# Altium schematic sheet Slaves_Testbench.SchDoc
size A4 portrait; SheetNumber: 1; SheetTotal: 1
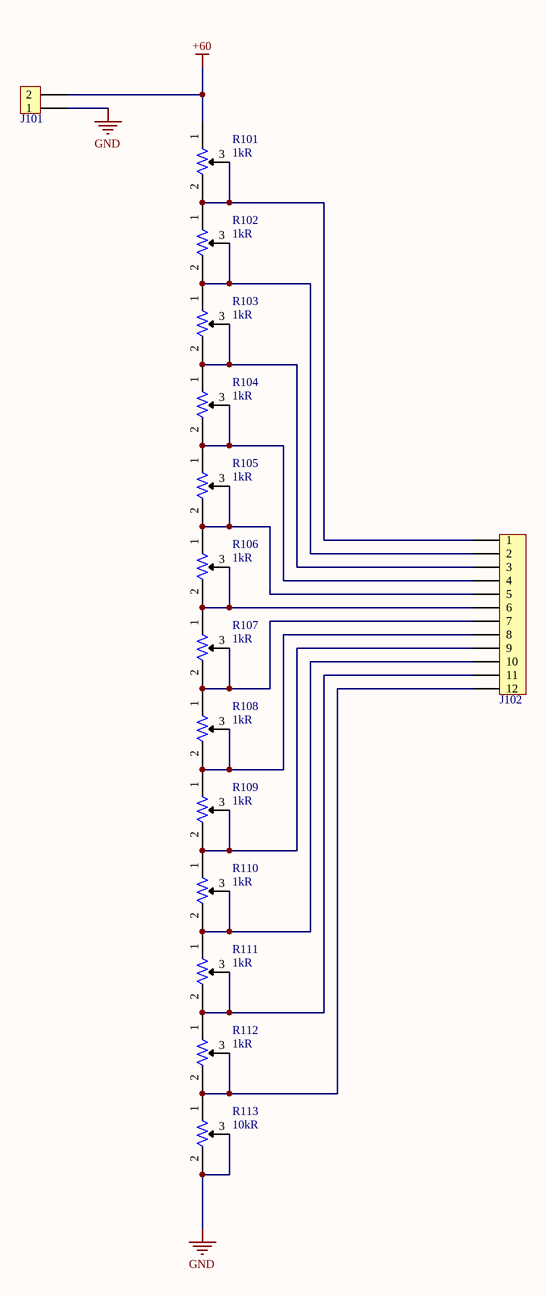
[diagram p0: Slaves_Testbench.SchDoc]

## Parts
J101  282836-2  [J_screw_1x2]  (value not drawn)
J102  436501200  [J_MicroFit_1x12]  (value not drawn)
R101  Resistance: 1kR  [R-VTR_RM065]  (hidden comment: R1k-VTR_RM065)
R102  Resistance: 1kR  [R-VTR_RM065]  (hidden comment: R1k-VTR_RM065)
R103  Resistance: 1kR  [R-VTR_RM065]  (hidden comment: R1k-VTR_RM065)
R104  Resistance: 1kR  [R-VTR_RM065]  (hidden comment: R1k-VTR_RM065)
R105  Resistance: 1kR  [R-VTR_RM065]  (hidden comment: R1k-VTR_RM065)
R106  Resistance: 1kR  [R-VTR_RM065]  (hidden comment: R1k-VTR_RM065)
R107  Resistance: 1kR  [R-VTR_RM065]  (hidden comment: R1k-VTR_RM065)
R108  Resistance: 1kR  [R-VTR_RM065]  (hidden comment: R1k-VTR_RM065)
R109  Resistance: 1kR  [R-VTR_RM065]  (hidden comment: R1k-VTR_RM065)
R110  Resistance: 1kR  [R-VTR_RM065]  (hidden comment: R1k-VTR_RM065)
R111  Resistance: 1kR  [R-VTR_RM065]  (hidden comment: R1k-VTR_RM065)
R112  Resistance: 1kR  [R-VTR_RM065]  (hidden comment: R1k-VTR_RM065)
R113  Resistance: 10kR  [R-VTR_RM065]  (hidden comment: R10k-VTR_RM065)

## Nets
+60: J101.2 R101.1
GND: J101.1 R113.2 R113.3
NetJ102_1: J102.1 R101.2 R101.3 R102.1
NetJ102_2: J102.2 R102.2 R102.3 R103.1
NetJ102_3: J102.3 R103.2 R103.3 R104.1
NetJ102_4: J102.4 R104.2 R104.3 R105.1
NetJ102_5: J102.5 R105.2 R105.3 R106.1
NetJ102_6: J102.6 R106.2 R106.3 R107.1
NetJ102_7: J102.7 R107.2 R107.3 R108.1
NetJ102_8: J102.8 R108.2 R108.3 R109.1
NetJ102_9: J102.9 R109.2 R109.3 R110.1
NetJ102_10: J102.10 R110.2 R110.3 R111.1
NetJ102_11: J102.11 R111.2 R111.3 R112.1
NetJ102_12: J102.12 R112.2 R112.3 R113.1

## Library data of the parts
J101 = J_CON2x1: Connector, Terminal Block; Wire Receptacle; 2 Pos.; 16-30 AWG; 0.197 in. CL; Sid; Manufacturer 1: TE Connectivity; Supplier 1: Arrow Electronics; Manufacturer Part Number 1: 282836-2; RoHS: Yes; Category: Terminal Blocks; Stock 1: 8391; Pricing 1: 1=0,41710, 10=0,36230, 100=0,30770, 500=0,29220, 1000=0,26130, 2500=0,23640, 5000=0,21140, 10000=0,20690, 25000=0,20320 (USD); ComponentLink1URL: https://datasheet.ciiva.com/15169/getdatasheetpartid-155855-15169553.pdf?src-supplier=Verical; ComponentLink1Description: https://datasheet.ciiva.com/15169/getdatasheetpartid-155855-15169553.pdf?src-supplier=Verical; ComponentLink2URL: https://datasheet.ciiva.com/16393/282836-2-16393382.pdf?src-supplier=Future+Electronics; ComponentLink2Description: https://datasheet.ciiva.com/16393/282836-2-16393382.pdf?src-supplier=Future+Electronics; ComponentLink3URL: https://datasheet.ciiva.com/11757/0900766b8002dc8a-11757385.pdf?src-supplier=RSComponents; ComponentLink3Description: https://datasheet.ciiva.com/11757/0900766b8002dc8a-11757385.pdf?src-supplier=RSComponents; ComponentLink4URL: https://datasheet.ciiva.com/7628/1731782-7628513.pdf?src-supplier=Element14; ComponentLink4Description: https://datasheet.ciiva.com/7628/1731782-7628513.pdf?src-supplier=Element14; ComponentLink5URL: https://datasheet.ciiva.com/823/eng-cd-282836-h10-823437.pdf?src-supplier=Digi-Key; ComponentLink5Description: https://datasheet.ciiva.com/823/eng-cd-282836-h10-823437.pdf?src-supplier=Digi-Key; ComponentLink6URL: https://datasheet.ciiva.com/3141/eng-cs-1308389-eurostyle-terminal-blocks-0607-3141118.pdf?src-supplier=Avnet; ComponentLink6Description: https://datasheet.ciiva.com/3141/eng-cs-1308389-eurostyle-terminal-blocks-0607-3141118.pdf?src-supplier=Avnet; ComponentLink7URL: https://datasheet.ciiva.com/30261/eng-cs-1308389-eurostyle-terminal-blocks-0607-30261813.pdf?src-supplier=Onlinecomponents.com; ComponentLink7Description: https://datasheet.ciiva.com/30261/eng-cs-1308389-eurostyle-terminal-blocks-0607-30261813.pdf?src-supplier=Onlinecomponents.com; Supplier Part Number 1: 282836-2
J102 = J_MicroFit_1x12: Conn Power HDR 12 POS 3mm Solder RA Thru-Hole 12 Terminal 1 Port Micro-Fit 3.0™ Frame; Manufacturer 1: Molex; Manufacturer Part Number 1: 43650-1200; .Creator: DR; Supplier 1: Newark; RoHS: Yes; Category: Headers and Wire Housings; Stock 1: 13; Pricing 1: 1=3,36000, 10=2,96000, 25=2,76000, 50=2,56000, 100=2,36000, 250=2,08000 (USD); ComponentLink1URL: https://datasheet.ciiva.com/713/436500501-sd-713883.pdf?src-supplier=Digi-Key; ComponentLink1Description: https://datasheet.ciiva.com/713/436500501-sd-713883.pdf?src-supplier=Digi-Key; ComponentLink2URL: https://datasheet.ciiva.com/30240/0436501200-pcb-headers-30240499.pdf?src-supplier=Onlinecomponents.com; ComponentLink2Description: https://datasheet.ciiva.com/30240/0436501200-pcb-headers-30240499.pdf?src-supplier=Onlinecomponents.com; ComponentLink3URL: https://datasheet.ciiva.com/5150/0436501200-pcb-headers-168537-5150117.pdf?src-supplier=Mouser; ComponentLink3Description: https://datasheet.ciiva.com/5150/0436501200-pcb-headers-168537-5150117.pdf?src-supplier=Mouser; ComponentLink4URL: https://datasheet.ciiva.com/16086/1031430436501200-pcb-headers-16086097.pdf?src-supplier=Onlinecomponents.com; ComponentLink4Description: https://datasheet.ciiva.com/16086/1031430436501200-pcb-headers-16086097.pdf?src-supplier=Onlinecomponents.com; ComponentLink5URL: https://datasheet.ciiva.com/14155/04402066-14155230.pdf?src-supplier=Distrelec; ComponentLink5Description: https://datasheet.ciiva.com/14155/04402066-14155230.pdf?src-supplier=Distrelec; Supplier Part Number 1: 01AH1239
R101-R112 = R1k-VTR_RM065: Generic RM065 1k trimmer
R113 = R10k-VTR_RM065: Generic RM065 1k trimmer